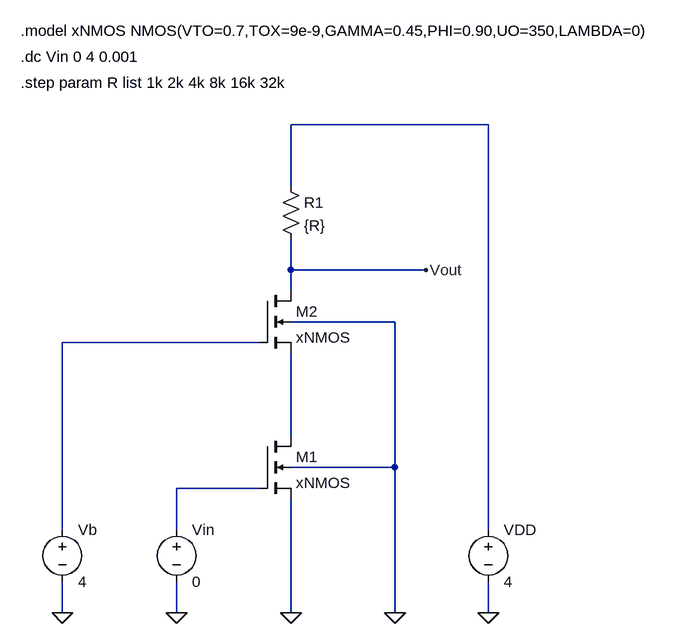
[diagram p0: schematic Chapter03_SPICE09.asc]
Chapter03_SPICE09.asc, the LTspice schematic file:
Version 4
SHEET 1 1244 1076
WIRE 768 304 464 304
WIRE 464 400 464 304
WIRE 464 528 464 480
WIRE 672 528 464 528
WIRE 464 560 464 528
WIRE 624 608 464 608
WIRE 416 640 112 640
WIRE 464 784 464 656
WIRE 624 832 624 608
WIRE 624 832 464 832
WIRE 416 864 288 864
WIRE 112 928 112 640
WIRE 288 928 288 864
WIRE 768 928 768 304
WIRE 112 1056 112 1008
WIRE 288 1056 288 1008
WIRE 464 1056 464 880
WIRE 624 1056 624 832
WIRE 768 1056 768 1008
FLAG 464 1056 0
FLAG 624 1056 0
FLAG 112 1056 0
FLAG 288 1056 0
FLAG 768 1056 0
FLAG 672 528 Vout
SYMBOL nmos4 416 560 R0
SYMATTR InstName M2
SYMATTR Value xNMOS
SYMBOL nmos4 416 784 R0
SYMATTR InstName M1
SYMATTR Value xNMOS
SYMBOL voltage 288 912 R0
SYMATTR InstName Vin
SYMATTR Value 0
SYMBOL voltage 112 912 R0
WINDOW 123 0 0 Left 0
WINDOW 39 0 0 Left 0
SYMATTR InstName Vb
SYMATTR Value 4
SYMBOL voltage 768 912 R0
SYMATTR InstName VDD
SYMATTR Value 4
SYMBOL res 448 384 R0
SYMATTR InstName R1
SYMATTR Value {R}
TEXT 48 160 Left 2 !.model xNMOS NMOS(VTO=0.7,TOX=9e-9,GAMMA=0.45,PHI=0.90,UO=350,LAMBDA=0)
TEXT 48 200 Left 2 !.dc Vin 0 4 0.001
TEXT 48 240 Left 2 !.step param R list 1k 2k 4k 8k 16k 32k

The netlist it stands for:
* Chapter03_SPICE09.asc
M2 Vout N002 N003 0 xNMOS
M1 N003 N004 0 0 xNMOS
Vin N004 0 0
Vb N002 0 4
VDD N001 0 4
R1 N001 Vout {R}
.model NMOS NMOS
.model PMOS PMOS
.lib standard.mos
.model xNMOS NMOS(VTO=0.7,TOX=9e-9,GAMMA=0.45,PHI=0.90,UO=350,LAMBDA=0)
.dc Vin 0 4 0.001
.step param R list 1k 2k 4k 8k 16k 32k
.backanno
.end